# Altium project DRSSTC.PrjPcb
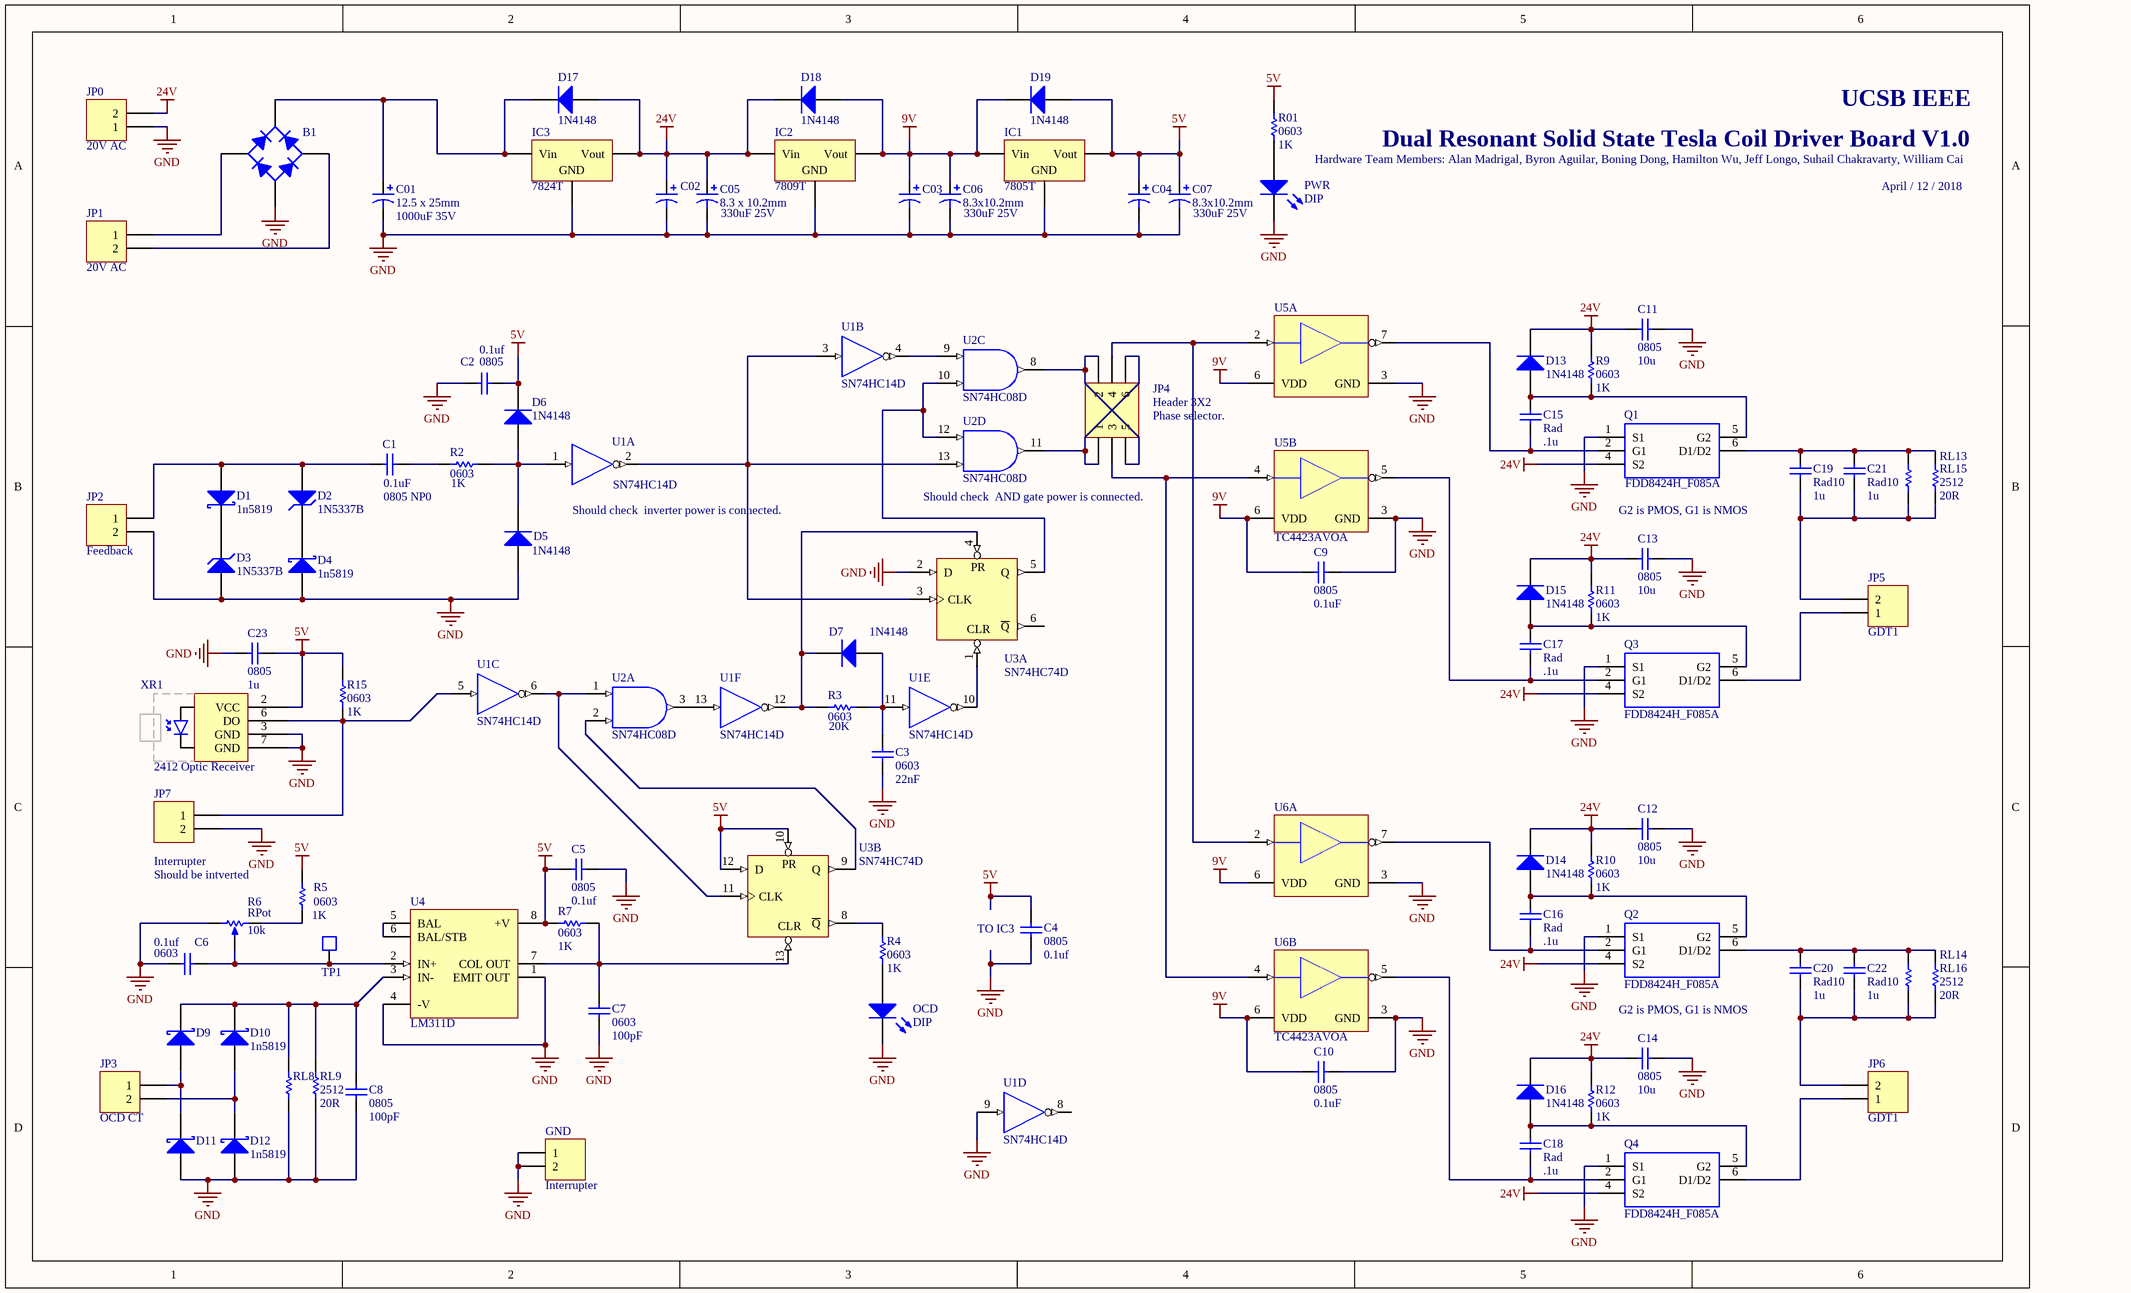
[diagram p0: MotherBoard.SchDoc]
1 sheet, 93 parts. Net scope: global (net labels, ports and power ports of the same name join across sheets).
Board file: Motherboard.PcbDoc

## Sheet MotherBoard.SchDoc
size B

### Parts
B1  (no value)  [KBP307]
C1  value 0.1uF  PackageReference: 0805 NP0  [D0805]
C01  12.5 x 25mm  value 1000uF 35V  [CAP_12_5X25]
C2  0805  value 0.1uf  [D0805]
C02  330uF  [CAPALUM8X10]  (value not drawn)
C3  0603  value 22nF  [D0603]
C03  (no value)  [CAPALUM8X10]
C4  0805  value 0.1uf  [D0805]
C04  (no value)  [CAPALUM8X10]
C5  0805  value 0.1uf  [D0805]
C05  8.3 x 10.2mm  value 330uF 25V  [CAPALUM8X10]
C6  0603  value 0.1uf  [D0603]
C06  8.3x10.2mm  value 330uF 25V  [CAPALUM8X10]
C7  0603  value 100pF  [D0603]
C07  8.3x10.2mm  value 330uF 25V  [CAPALUM8X10]
C8  0805  value 100pF  [D0805]
C9  0805  value 0.1uF  [D0805]
C10  0805  value 0.1uF  [D0805]
C11  0805  value 10u  [CAPC1206]
C12  0805  value 10u  [CAPC1206]
C13  0805  value 10u  [CAPC1206]
C14  0805  value 10u  [CAPC1206]
C15  Rad  value .1u  [RAD-0.1]
C16  Rad  value .1u  [RAD-0.1]
C17  Rad  value .1u  [RAD-0.1]
C18  Rad  value .1u  [RAD-0.1]
C19  Rad10  value 1u  [RAD-0.2]
C20  Rad10  value 1u  [RAD-0.2]
C21  Rad10  value 1u  [RAD-0.2]
C22  Rad10  value 1u  [RAD-0.2]
C23  0805  value 1u  [D0805]
D1  1n5819  [SOD123 STD]
D2  1N5337B  [1n533x]
D3  1N5337B  [1n533x]
D4  1n5819  [SOD123 STD]
D5  1N4148  [DO-35]
D6  1N4148  [DO-35]
D7  1N4148  [DO-35]
D9  1n5819  [SOD123 STD]  (value not drawn)
D10  1n5819  [SOD123 STD]
D11  1n5819  [SOD123 STD]  (value not drawn)
D12  1n5819  [SOD123 STD]
D13  1N4148  [DO-35]
D14  1N4148  [DO-35]
D15  1N4148  [DO-35]
D16  1N4148  [DO-35]
D17  1N4148  [DO-35]
D18  1N4148  [DO-35]
D19  1N4148  [DO-35]
GND  Interrupter  [HDR1X2]
IC1  7805T  [DPAK]
IC2  7809T  [DPAK]
IC3  7824T  [TO254P470X1016X2040-3P]
JP0  20V AC  [VH-2P-3.96]
JP1  20V AC  [VH-2P-3.96]
JP2  Feedback  [VH-2P-3.96]
JP3  OCD CT  [VH-2P-3.96]
JP4  Header 3X2  [HDR2X3]
JP5  GDT1  [VH-2P-3.96]
JP6  GDT1  [VH-2P-3.96]
JP7  Interrupter  [HDR1X2]
OCD  DIP  [HDR1X2]
PWR  DIP  [HDR1X2]
Q1  FDD8424H_F085A  [DUAL_DPAK_4L1]
Q2  FDD8424H_F085A  [DUAL_DPAK_4L1]
Q3  FDD8424H_F085A  [DUAL_DPAK_4L1]
Q4  FDD8424H_F085A  [DUAL_DPAK_4L1]
R01  0603  value 1K  [D0603]
R2  0603  value 1K  [D0603]
R3  0603  value 20K  [D0603]
R4  0603  value 1K  [D0603]
R5  0603  value 1K  [D0603]
R6  RPot  value 10k  [3296W]
R7  0603  value 1K  [D0603]
R9  0603  value 1K  [D0603]
R10  0603  value 1K  [D0603]
R11  0603  value 1K  [D0603]
R12  0603  value 1K  [D0603]
R15  0603  value 1K  [D0603]
RL8  2512  [AXIAL-0.4]  (value not drawn)
RL9  2512  value 20R  [AXIAL-0.4]
RL13  2512  [AXIAL-0.4]  (value not drawn)
RL14  2512  [AXIAL-0.4]  (value not drawn)
RL15  2512  value 20R  [AXIAL-0.4]
RL16  2512  value 20R  [AXIAL-0.4]
TP1  TP  [TP0_8]  (value not drawn)
U1  SN74HC14D  [D014_N]  (parts A,B,C,D,E,F of 6)
U2  SN74HC08D  [D014_N]  (parts A,C,D of 4)
U3  SN74HC74D  [D014_N]  (parts A,B of 2)
U4  LM311D  [D008_M]
U5  TC4423AVOA  [SOIC-OA8_N]  (value not drawn)  (parts A,B of 3)
U6  TC4423AVOA  [SOIC-OA8_N]  (value not drawn)  (parts A,B of 3)
XR1  2412 Optic Receiver  [OPF2412T]

### Nets
5V: C2.2 C04.1 C4.2 C5.1 C07.1 C23.2 D6.2(K) D19.1(A) IC1.3(Vout) R01.2 R5.2 R7.1 R15.2 U1.14(VCC) U2.14(VCC) U3.10(PR) U3.12(D) U3.14(VCC) U4.8(+V) XR1.2(VCC)
9V: C03.1 C06.1 C9.2 C10.2 D18.1(A) D19.2(K) IC1.1(Vin) IC2.3(Vout) U5.6(VDD) U6.6(VDD)
24V: C02.1 C05.1 C11.2 C12.2 C13.1 C14.1 D13.2(K) D14.2(K) D15.2(K) D16.2(K) D17.1(A) D18.2(K) IC2.1(Vin) IC3.3(Vout) JP0.2 Q1.4(S2) Q2.4(S2) Q3.4(S2) Q4.4(S2) R9.2 R10.2 R11.2 R12.2
GND: B1.3(A) C01.2 C2.1 C02.2 C3.1 C03.2 C4.1 C04.2 C5.2 C05.2 C6.2 C06.2 C7.1 C07.2 C8.1 C9.1 C10.1 C11.1 C12.1 C13.2 C14.2 C23.1 D3.A D4.A D5.1(A) D11.A D12.A GND.1 GND.2 IC1.2(GND) IC2.2(GND) IC3.2(GND) JP0.1 JP2.2 JP7.2 OCD.2(K) PWR.2(K) Q1.1(S1) Q2.1(S1) Q3.1(S1) Q4.1(S1) R6.1(TOP) RL8.1 RL9.1 U1.7(GND) U1.9(A) U2.7(GND) U3.2(D) U3.7(GND) U4.1(EMIT_OUT) U4.4(-V) U5.3(GND) U6.3(GND) XR1.3(GND) XR1.7(GND)
NetB1_1: B1.1(K) C01.1 D17.2(K) IC3.1(Vin)
NetB1_2: B1.2(C) JP1.2
NetB1_4: B1.4(C) JP1.1
NetC1_1: C1.1 R2.1
NetC1_2: C1.2 D1.A D2.A JP2.1
NetC3_2: C3.2 D7.1(A) R3.2 U1.11(A)
NetC6_1: C6.1 R6.2(TAP) TP1.1(TP) U4.2(IN+)
NetC7_2: C7.2 R7.2 U3.13(CLR) U4.7(COL_OUT)
NetC8_2: C8.2 D9.C D10.C RL8.2 RL9.2 U4.3(IN-)
NetC15_1: C15.1 D13.1(A) Q1.5(G2) R9.1
NetC15_2: C15.2 Q1.2(G1) U5.7(~{OUTA})
NetC16_1: C16.1 D14.1(A) Q2.5(G2) R10.1
NetC16_2: C16.2 Q2.2(G1) U6.7(~{OUTA})
NetC17_1: C17.1 D15.1(A) Q3.5(G2) R11.1
NetC17_2: C17.2 Q3.2(G1) U5.5(~{OUTB})
NetC18_1: C18.1 D16.1(A) Q4.5(G2) R12.1
NetC18_2: C18.2 Q4.2(G1) U6.5(~{OUTB})
NetC19_1: C19.1 C21.1 JP5.2 RL13.1 RL15.1
NetC19_2: C19.2 C21.2 Q1.6(D1/D2) RL13.2 RL15.2
NetC20_1: C20.1 C22.1 JP6.2 RL14.1 RL16.1
NetC20_2: C20.2 C22.2 Q2.6(D1/D2) RL14.2 RL16.2
NetD1_C: D1.C D3.K
NetD2_K: D2.K D4.C
NetD5_2: D5.2(K) D6.1(A) R2.2 U1.1(A)
NetD7_2: D7.2(K) R3.1 U1.12(Y) U3.4(PR)
NetD9_A: D9.A D11.C JP3.1
NetD10_A: D10.A D12.C JP3.2
NetJP4_1: JP4.1 JP4.6 U2.11(Y)
NetJP4_2: JP4.2 JP4.5 U2.8(Y)
NetJP4_3: JP4.3 U5.4(INB) U6.4(INB)
NetJP4_4: JP4.4 U5.2(INA) U6.2(INA)
NetJP5_1: JP5.1 Q3.6(D1/D2)
NetJP6_1: JP6.1 Q4.6(D1/D2)
NetJP7_1: JP7.1 R15.1 U1.5(A) XR1.6(DO)
NetOCD_1: OCD.1(A) R4.1
NetPWR_1: PWR.1(A) R01.1
NetR4_2: R4.2 U3.8(~{Q})
NetR5_1: R5.1 R6.3(BOT)
NetU1_2: U1.2(Y) U1.3(A) U2.13(B) U3.3(CLK)
NetU1_4: U1.4(Y) U2.9(A)
NetU1_6: U1.6(Y) U2.1(A) U3.11(CLK)
NetU1_10: U1.10(Y) U3.1(CLR)
NetU1_13: U1.13(A) U2.3(Y)
NetU2_2: U2.2(B) U3.9(Q)
NetU2_10: U2.10(B) U2.12(A) U3.5(Q)
NetU4_5: U4.5(BAL) U4.6(BAL/STB)

Not connected (* = marked no-connect by the designer): U1 8(Y); U3 6(~{Q})

### Notes on the sheet
- Hardware Team Members: Alan Madrigal, Byron Aguilar, Boning Dong, Hamilton Wu, Jeff Longo, Suhail Chakravarty, William Cai
- Dual Resonant Solid State Tesla Coil Driver Board V1.0
- UCSB IEEE
- April / 12 / 2018
- Phase selector.
- (near U2) Should check  AND gate power is connected.
- Should check  inverter power is connected.
- G2 is PMOS, G1 is NMOS
- Should be intverted
- (near C4) TO IC3

### Library data of the parts
B1 = Bridge1: Full Wave Diode Bridge; Published: 8-Jun-2000; LatestRevisionDate: 29-May-2009; LatestRevisionNote: Sch pins A & K swapped.; DatasheetVersion: E2732B; PackageReference: D-38; Publisher: Altium Limited; PackageDescription: Bridge Rectifier; 4 Terminals; Body 9.4 x 9.4 mm (typ); Pitch 5.08 mm
C1-C23 = Cap: Capacitor; Published: 8-Jun-2000; LatestRevisionDate: 17-Jul-2002; LatestRevisionNote: Re-released for DXP Platform.; Publisher: Altium Limited; PackageDescription: Radial Cap, Thru-Hole; 2 Leads; 0.3 in Pin Spacing
  C2-C23: PackageReference: RAD-0.3
C01 C02 C05 C06 C07 = Cap Pol1: Polarized Capacitor (Radial); Published: 8-Jun-2000; LatestRevisionDate: 17-Jul-2002; LatestRevisionNote: Re-released for DXP Platform.; PackageReference: RB7.6-15; Publisher: Altium Limited; PackageDescription: Polarized Capacitor (Radial); 2 Leads
C03 C04 = Cap Pol1: Polarized Capacitor (Radial); Value: 330uF; Published: 8-Jun-2000; LatestRevisionDate: 17-Jul-2002; LatestRevisionNote: Re-released for DXP Platform.; PackageReference: RB7.6-15; Publisher: Altium Limited; PackageDescription: Polarized Capacitor (Radial); 2 Leads
D1 D4 D9-D12 = Component_1: 1N5819 Diode
D2 D3 = D Zener: Zener Diode; Published: 8-Jun-2000; LatestRevisionDate: 17-Jul-2002; LatestRevisionNote: Re-released for DXP Platform.; PackageReference: DIODE-0.7; Publisher: Altium Limited; PackageDescription: Diode, Thru-Hole; 2 Leads; 0.7 in Pin Spacing
D5-D7 = Diode: Default Diode; Published: 8-Jun-2000; LatestRevisionDate: 17-Jul-2002; LatestRevisionNote: Re-released for DXP Platform.; PackageVersion: Sep-1996; PackageReference: SMC; Publisher: Altium Limited; PackageDescription: DO-214-AB/SMC; 2 C-Bend Leads; Body 7.9 x 5.9 mm, inc. leads (LxW); Code_JEDEC: DO-214-AB
D13-D19 = 1N4148: High Conductance Fast Diode; Published: 8-Jun-2000; LatestRevisionDate: 17-Jul-2002; LatestRevisionNote: Re-released for DXP Platform.; DatasheetDocument: 1997; PackageReference: DO-35; Publisher: Altium Limited; Code_JEDEC: DO-204-AH; ComponentLink1Description: Manufacturer Link; ComponentLink1URL: http://www.fairchildsemi.com/; ComponentLink2Description: Datasheet; ComponentLink2URL: http://www.fairchildsemi.com/ds/1N%2F1N4148.pdf
GND JP0-JP3 JP5-JP7 = Header 2: Header, 2-Pin; LatestRevisionDate: 17-Jul-2002; LatestRevisionNote: Re-released for DXP Platform.; Publisher: Altium Limited
IC1-IC3 = Volt Reg: Voltage Regulator; Published: 24-Mar-1999; LatestRevisionDate: 29-May-2009; LatestRevisionNote: IPC-7351 Footprint Added.; PackageReference: D2PAK; Publisher: Altium Limited; PackageDescription: 3-Pin Transistor Outline Package 2.54 mm Pitch, 15.1 mm Lead Span
JP4 = Header 3X2: Header, 3-Pin, Dual row; LatestRevisionDate: 17-Jul-2002; LatestRevisionNote: Re-released for DXP Platform.; Publisher: Altium Limited
OCD PWR = LED3: Typical BLUE SiC LED; Published: 8-Jun-2000; LatestRevisionDate: 17-Dec-2003; LatestRevisionNote: PCB Footprint replaced.; DatasheetVersion: 16-Apr-2002; PackageVersion: 16-Apr-2002; PackageReference: 3.5X2.8X1.9; Publisher: Altium Limited; PackageDescription: SM LED; 2 C-Bend Leads; Body 3.5 x 2.8 x 1.9 mm, inc leads (LxWxH typ)
Q1-Q4 = FDD8424H_F085A: MOSFET Dual N&PCH PwrTrench +/- 40V,20A; Manufacturer_Name: Fairchild Semiconductor; Manufacturer_Part_Number: FDD8424H_F085A; RS Part Number: 8648102P; RS Price/Stock: http://uk.rs-online.com/web/p/products/8648102P; Datasheet Link: http://www.mouser.com/ds/2/308/FDD8424H_F085A-1122839.pdf
R01-R5 R7 R9-R12 R15 RL9 RL15 RL16 = Res1: Resistor; Published: 8-Jun-2000; LatestRevisionDate: 17-Jul-2002; LatestRevisionNote: Re-released for DXP Platform.; PackageReference: AXIAL-0.3; Publisher: Altium Limited; PackageDescription: Axial Device, Thru-Hole; 2 Leads; 0.3 in Pin Spacing
R6 = RPot: Trimpot
RL8 RL13 = Res1: Resistor; Value: 20R; Published: 8-Jun-2000; LatestRevisionDate: 17-Jul-2002; LatestRevisionNote: Re-released for DXP Platform.; PackageReference: AXIAL-0.3; Publisher: Altium Limited; PackageDescription: Axial Device, Thru-Hole; 2 Leads; 0.3 in Pin Spacing
RL14 = Res1: Resistor; Value: 1K; Published: 8-Jun-2000; LatestRevisionDate: 17-Jul-2002; LatestRevisionNote: Re-released for DXP Platform.; PackageReference: AXIAL-0.3; Publisher: Altium Limited; PackageDescription: Axial Device, Thru-Hole; 2 Leads; 0.3 in Pin Spacing
U1 = SN74HC14D: Hex Schmitt-Trigger Inverter; Published: 8-Jun-2000; LatestRevisionDate: 13-Apr-2006; LatestRevisionNote: IPC-7351 Footprint Added.; DatasheetVersion: May-1997; PackageVersion: Jan-1998; PackageReference: D014; Publisher: Altium Limited; PackageDescription: 14-Pin Small Outline Integrated Circuit 1.27 mm Pitch; Code_IPC: SOIC127P600-14; ComponentLink1Description: Manufacturer Link; ComponentLink1URL: http://www.ti.com/; ComponentLink2Description: Datasheet; ComponentLink2URL: http://www-s.ti.com/sc/ds/sn74hc14.pdf
U2 = SN74HC08D: Quadruple 2-Input Positive-AND Gate; Published: 8-Jun-2000; LatestRevisionDate: 13-Apr-2006; LatestRevisionNote: IPC-7351 Footprint Added.; DatasheetVersion: May-1997; PackageVersion: Jan-1998; PackageReference: D014; Publisher: Altium Limited; PackageDescription: 14-Pin Small Outline Integrated Circuit 1.27 mm Pitch; Code_IPC: SOIC127P600-14; ComponentLink1Description: Manufacturer Link; ComponentLink1URL: http://www.ti.com/; ComponentLink2Description: Datasheet; ComponentLink2URL: http://www-s.ti.com/sc/ds/SN74HC08.pdf
U3 = SN74HC74D: Dual D-Type Positive-Edge-Triggered Flip-Flop with Clear and Preset; Published: 8-Jun-2000; LatestRevisionDate: 13-Apr-2006; LatestRevisionNote: IPC-7351 Footprint Added.; DatasheetVersion: May-1997; PackageVersion: Jan-1998; PackageReference: D014; Publisher: Altium Limited; PackageDescription: 14-Pin Small Outline Integrated Circuit 1.27 mm Pitch; Code_IPC: SOIC127P600-14; ComponentLink1Description: Manufacturer Link; ComponentLink1URL: http://www.ti.com/; ComponentLink2Description: Datasheet; ComponentLink2URL: http://www-s.ti.com/sc/ds/sn74hc74.pdf
U4 = LM111JG: Differential Comparator with Strobe; Published: 16-Jan-2001; LatestRevisionDate: 04-Mar-2005; LatestRevisionNote: Stylized 3D Model Added.; DatasheetVersion: Feb-1992; PackageVersion: Jan-1995; PackageReference: JG008; Publisher: Altium Limited; PackageDescription: DIP; 8 Leads; Row Spacing 7.62 mm; Pitch 2.54 mm; ComponentLink1Description: Manufacturer Link; ComponentLink1URL: http://www.ti.com/; ComponentLink2Description: Datasheet; ComponentLink2URL: http://www-s.ti.com/sc/ds/lm111.pdf
U5 U6 = TC4423AVOA: 3A Dual High-Speed Power MOSFET Drivers, Inverting, Extended Temperature; Published: 29-Jan-2009; LatestRevisionDate: 01-Mar-2010; LatestRevisionNote: Sch Layout changed.; DatasheetVersion: revB, Apr-2007; PackageVersion: revBB, Aug-2009; PackageReference: SOIC-OA8; Publisher: Altium Limited; PackageDescription: 8-Lead Plastic Small Outline (OA) - Narrow, 3.90mm Body [SOIC]; Supplier 1: Digi-Key; Supplier Part Number 1: TC4423AVOA-ND; Code_IPC: SOIC127P600-8; ComponentLink1Description: Datasheet; ComponentLink1URL: http://ww1.microchip.com/downloads/en/DeviceDoc/21998b.pdf; ComponentLink2Description: Packaging Specification; ComponentLink2URL: http://www.microchip.com/stellent/groups/techpub_sg/documents/packagingspec/en012702.pdf; ComponentLink3Description: Microchip.com Home; ComponentLink3URL: http://www.microchip.com/
XR1 = OPF2412T: Optic Receiver